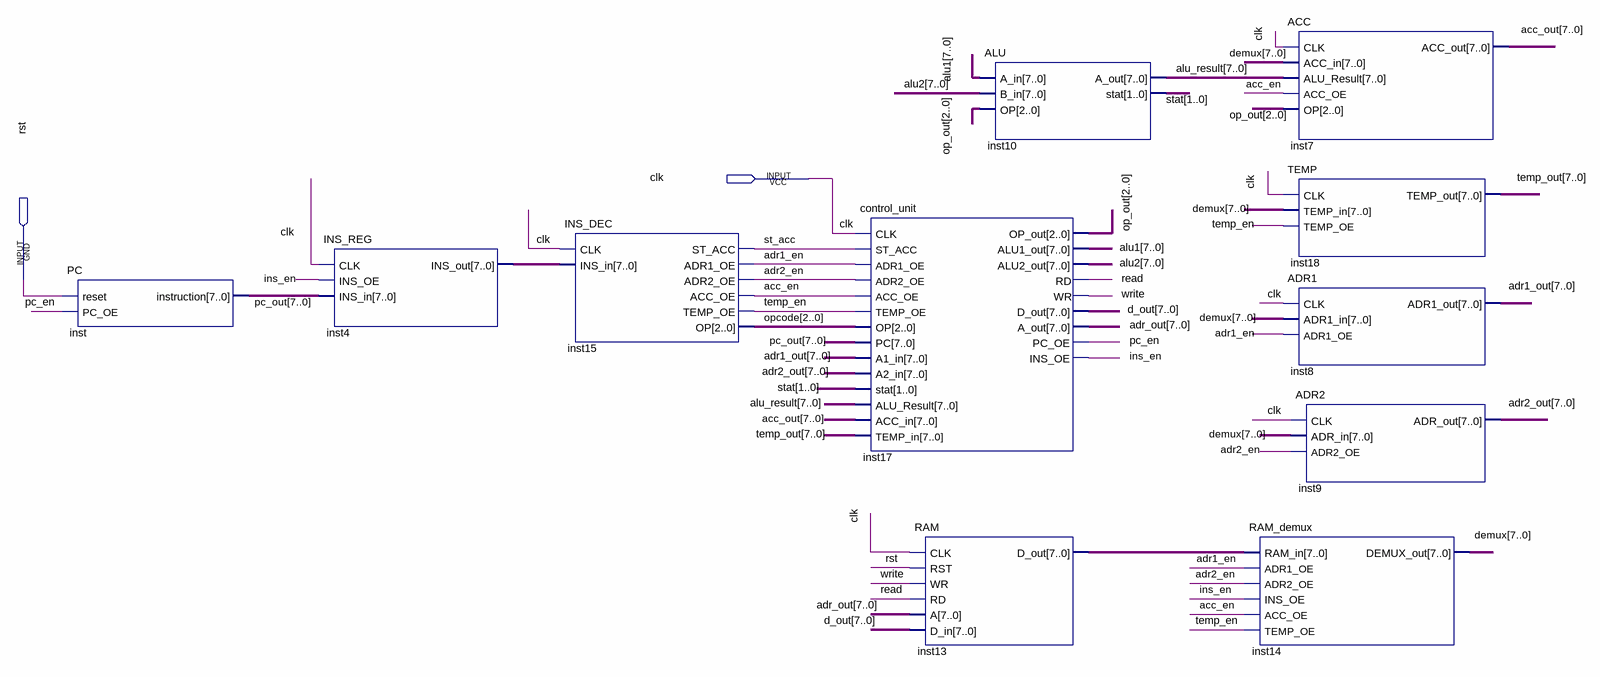
[diagram p0: schematic sheet]
// Quartus schematic Architecture.bdf as structural Verilog: 11 symbols, 2 pins
module Architecture (
  input  clk,
  input  rst
);

  wire acc_en, adr1_en, adr2_en, ins_en, pc_en, read, st_acc, temp_en, write;
  wire [1:0] stat;
  wire [2:0] op_out, opcode;
  wire [7:0] acc_out, adr1_out, adr2_out, adr_out, alu1, alu2, alu_result, d_out, demux, inst4_ins_out,
       inst13_d_out, pc_out, temp_out;

  PC inst (.reset(rst), .PC_OE(pc_en), .instruction(pc_out));
  INS_REG inst4 (.CLK(clk), .INS_OE(ins_en), .INS_in(pc_out), .INS_out(inst4_ins_out));
  INS_DEC inst15 (
    .CLK(clk), .INS_in(inst4_ins_out), .ST_ACC(st_acc), .ADR1_OE(adr1_en), .ADR2_OE(adr2_en),
    .ACC_OE(acc_en), .TEMP_OE(temp_en), .OP(opcode));
  control_unit inst17 (
    .CLK(clk), .ST_ACC(st_acc), .ADR1_OE(adr1_en), .ADR2_OE(adr2_en), .ACC_OE(acc_en), .TEMP_OE(temp_en),
    .OP(opcode), .PC(pc_out), .A1_in(adr1_out), .A2_in(adr2_out), .stat(stat), .ALU_Result(alu_result),
    .ACC_in(acc_out), .TEMP_in(temp_out), .OP_out(op_out), .ALU1_out(alu1), .ALU2_out(alu2), .RD(read),
    .WR(write), .D_out(d_out), .A_out(adr_out), .PC_OE(pc_en), .INS_OE(ins_en));
  RAM inst13 (.CLK(clk), .RST(rst), .WR(write), .RD(read), .A(adr_out), .D_in(d_out), .D_out(inst13_d_out));
  ALU inst10 (.A_in(alu1), .B_in(alu2), .OP(op_out), .A_out(alu_result), .stat(stat));
  RAM_demux inst14 (
    .RAM_in(inst13_d_out), .ADR1_OE(adr1_en), .ADR2_OE(adr2_en), .INS_OE(ins_en), .ACC_OE(acc_en),
    .TEMP_OE(temp_en), .DEMUX_out(demux));
  ACC inst7 (.CLK(clk), .ACC_in(demux), .ALU_Result(alu_result), .ACC_OE(acc_en), .OP(op_out), .ACC_out(acc_out));
  TEMP inst18 (.CLK(clk), .TEMP_in(demux), .TEMP_OE(temp_en), .TEMP_out(temp_out));
  ADR1 inst8 (.CLK(clk), .ADR1_in(demux), .ADR1_OE(adr1_en), .ADR1_out(adr1_out));
  ADR2 inst9 (.CLK(clk), .ADR_in(demux), .ADR2_OE(adr2_en), .ADR_out(adr2_out));
endmodule
